# EAGLE design PIC10FXXX_dev (EAGLE 5.11)
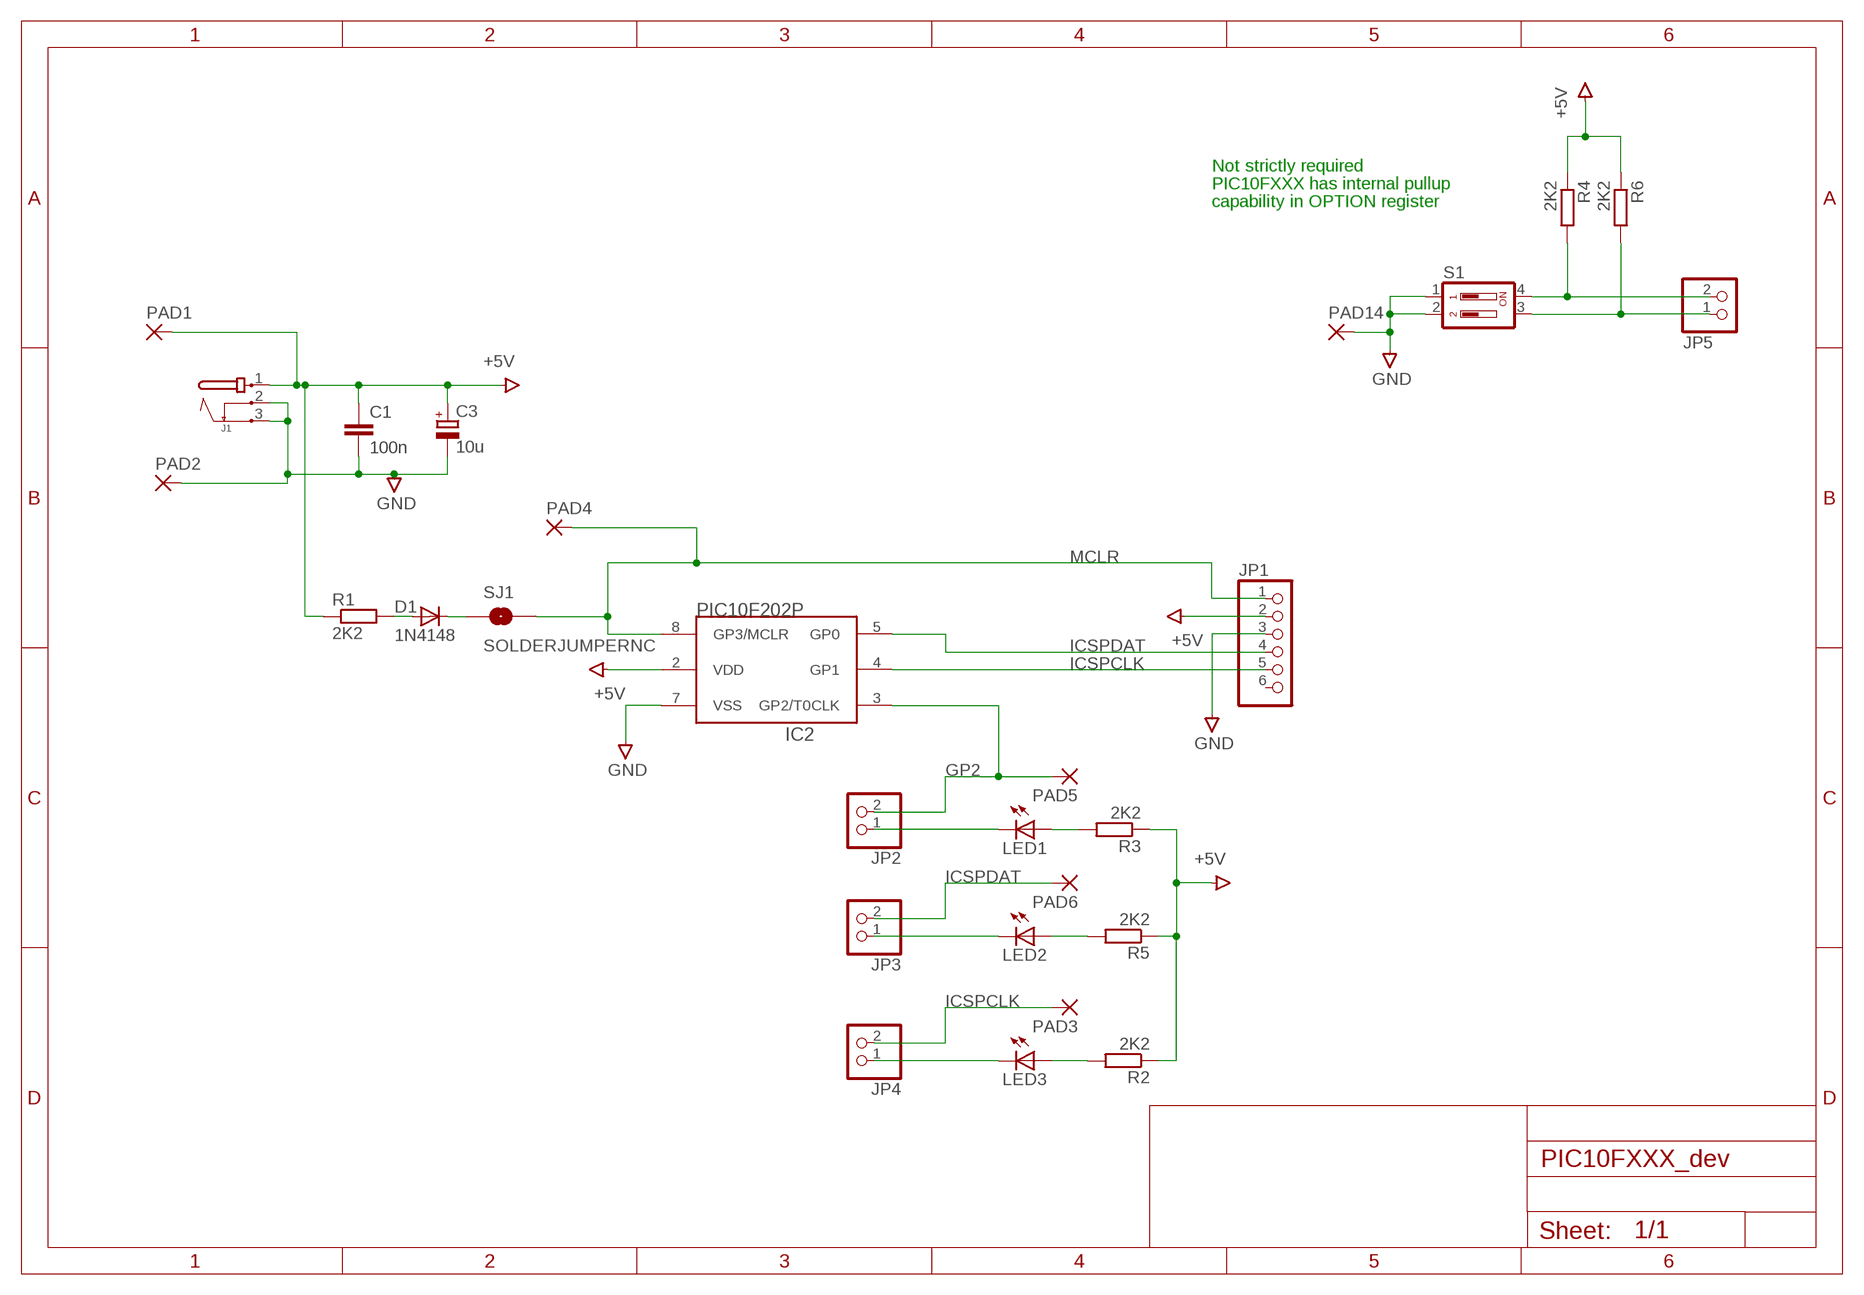
[diagram p0: schematic, sheet 1]

## Parts
C1  100n  C-EU050-035X075  [C050-035X075]
C3  10u  CPOL-EUE2.5-5  [E2,5-5]
D1  1N4148  1N4148DO35-7  [DO35-7]
IC2  PIC10F202P  [DIL8]
J1  JACK-PMS  [JACK-PMS]
JP1  PINHD-1X6  [1X06]
JP2  PINHD-1X2  [1X02]
JP3  PINHD-1X2  [1X02]
JP4  PINHD-1X2  [1X02]
JP5  PINHD-1X2  [1X02]
LED1  LED3MM  [LED3MM]
LED2  LED3MM  [LED3MM]
LED3  LED3MM  [LED3MM]
PAD1  2,15/1,0  [2,15/1,0]
PAD2  2,15/1,0  [2,15/1,0]
PAD3  2,15/1,0  [2,15/1,0]
PAD4  2,15/1,0  [2,15/1,0]
PAD5  2,15/1,0  [2,15/1,0]
PAD6  2,15/1,0  [2,15/1,0]
PAD14  2,15/1,0  [2,15/1,0]
R1  2K2  R-EU_0204/7  [0204/7]
R2  2K2  R-EU_0204/7  [0204/7]
R3  2K2  R-EU_0204/7  [0204/7]
R4  2K2  R-EU_0204/2V  [0204V]
R5  2K2  R-EU_0204/7  [0204/7]
R6  2K2  R-EU_0204/2V  [0204V]
S1  DIP02YL  [DIP02YL]
SJ1  SOLDERJUMPERNC  [SJ_2S]

## Nets
+5V: C1.1 C3.+ IC2.2(VDD) J1.1 JP1.2 PAD1.1(P) R1.1 R2.1 R3.1 R4.1 R5.1 R6.1
GND: C1.2 C3.- IC2.7(VSS) J1.2 J1.3 JP1.3 PAD2.1(P) PAD14.1(P) S1.1 S1.2
GP2: IC2.3(GP2/T0CLK) JP2.2 PAD5.1(P)
ICSPCLK: IC2.4(GP1) JP1.5 JP4.2 PAD3.1(P)
ICSPDAT: IC2.5(GP0) JP1.4 JP3.2 PAD6.1(P)
MCLR: IC2.8(GP3/MCLR) JP1.1 PAD4.1(P) SJ1.2
N$1: D1.C SJ1.1
N$2: D1.A R1.2
N$3: LED3.A R2.2
N$4: LED1.A R3.2
N$6: JP4.1 LED3.K(C)
N$10: LED2.A R5.2
N$11: JP3.1 LED2.K(C)
N$12: JP2.1 LED1.K(C)
N$15: JP5.2 R4.2 S1.4
N$16: JP5.1 R6.2 S1.3
Unconnected: JP1.6

## Notes on the sheet
- Not strictly required
- PIC10FXXX has internal pullup
- capability in OPTION register

## Library data of the parts
C1 = rcl:C-EU: CAPACITOR, European symbol
C3 = rcl:CPOL-EU: POLARIZED CAPACITOR, European symbol
D1 = diode:1N4148: DIODE high speed (Philips)
IC2 = microchip-5:PIC10F20*: uPC nW 0,25/0,5k Program Flash memory
J1 = POWER-IN:JACK-PMS
JP1 = pinhead:PINHD-1X6: PIN HEADER
JP2-JP5 = pinhead:PINHD-1X2: PIN HEADER
LED1-LED3 = led:LED: LED OSRAM: - CHIPLED LG R971, LG N971, LY N971, LG Q971, LY Q971, LO R971, LY R971 LH N974, LH R974 LS Q976, LO Q976, LY Q976 LO Q996 - Hyper CHIPLED LW Q18S LB Q993, LB Q99A, LB R99A - SideLED LS A670, LO A670, LY A670, LG A670, LP A670 LB A673, LV A673, LT A673, LW A673 LH A674 LY A675 LS A676, LA A676, LO A676, LY A676, LW A676 LS A679, LY A679, LG A679 - Hyper Micro SIDELED® LS Y876, LA Y876, LO Y876, LY Y876 LT Y87S - SmartLED LW L88C, LW L88S LB L89C, LB L89S, LG L890 LS L89K, LO L89K, LY L89K LS L896, LA L896, LO L896, LY L896 - TOPLED LS T670, LO T670, LY T670, LG T670, LP T670 LSG T670, LSP T670, LSY T670, LOP T670, LYG T670 LG T671, LOG T671, LSG T671 LB T673, LV T673, LT T673, LW T673 LH T674 LS T676, LA T676, LO T676, LY T676, LB T676, LH T676, LSB T676, LW T676 LB T67C, LV T67C, LT T67C, LS T67K, LO T67K, LY T67K, LW E67C LS E67B, LA E67B, LO E67B, LY E67B, LB E67C, LV E67C, LT E67C LW T67C LS T679, LY T679, LG T679 LS T770, LO T770, LY T770, LG T770, LP T770 LB T773, LV T773, LT T773, LW T773 LH T774 LS E675, LA E675, LY E675, LS T675 LS T776, LA T776, LO T776, LY T776, LB T776 LHGB T686 LT T68C, LB T68C - Hyper Mini TOPLED® LB M676 - Mini TOPLED Santana® LG M470 LS M47K, LO M47K, LY M47K Source: http://www.osram.convergy.de LUXEON: - LUMILED® LXK2-PW12-R00, LXK2-PW12-S00, LXK2-PW14-U00, LXK2-PW14-V00 LXK2-PM12-R00, LXK2-PM12-S00, LXK2-PM14-U00 LXK2-PE12-Q00, LXK2-PE12-R00, LXK2-PE12-S00, LXK2-PE14-T00, LXK2-PE14-U00 LXK2-PB12-K00, LXK2-PB12-L00, LXK2-PB12-M00, LXK2-PB14-N00, LXK2-PB14-P00, LXK2-PB14-Q00 LXK2-PR12-L00, LXK2-PR12-M00, LXK2-PR14-Q00, LXK2-PR14-R00 LXK2-PD12-Q00, LXK2-PD12-R00, LXK2-PD12-S00 LXK2-PH12-R00, LXK2-PH12-S00 LXK2-PL12-P00, LXK2-PL12-Q00, LXK2-PL12-R00 Source: www.luxeon.com KINGBRIGHT: KA-3528ASYC Source: www.kingbright.com
PAD1-PAD6 PAD14 = wirepad:2,15/1,0: THROUGH-HOLE PAD
R1-R6 = rcl:R-EU_: RESISTOR, European symbol
S1 = switch-dil:DIP02YL: DIL/CODE SWITCH; OC_FARNELL: unknown; OC_NEWARK: unknown
SJ1 = SparkFun:SOLDERJUMPER: Solder Jumper Standard SMD solder jumper. Used to automate production. Two varients : Normally Open and Normally Closed are the same, but have different paste layers. NC will have a large amount of paste and should jumper during reflow.

## Board
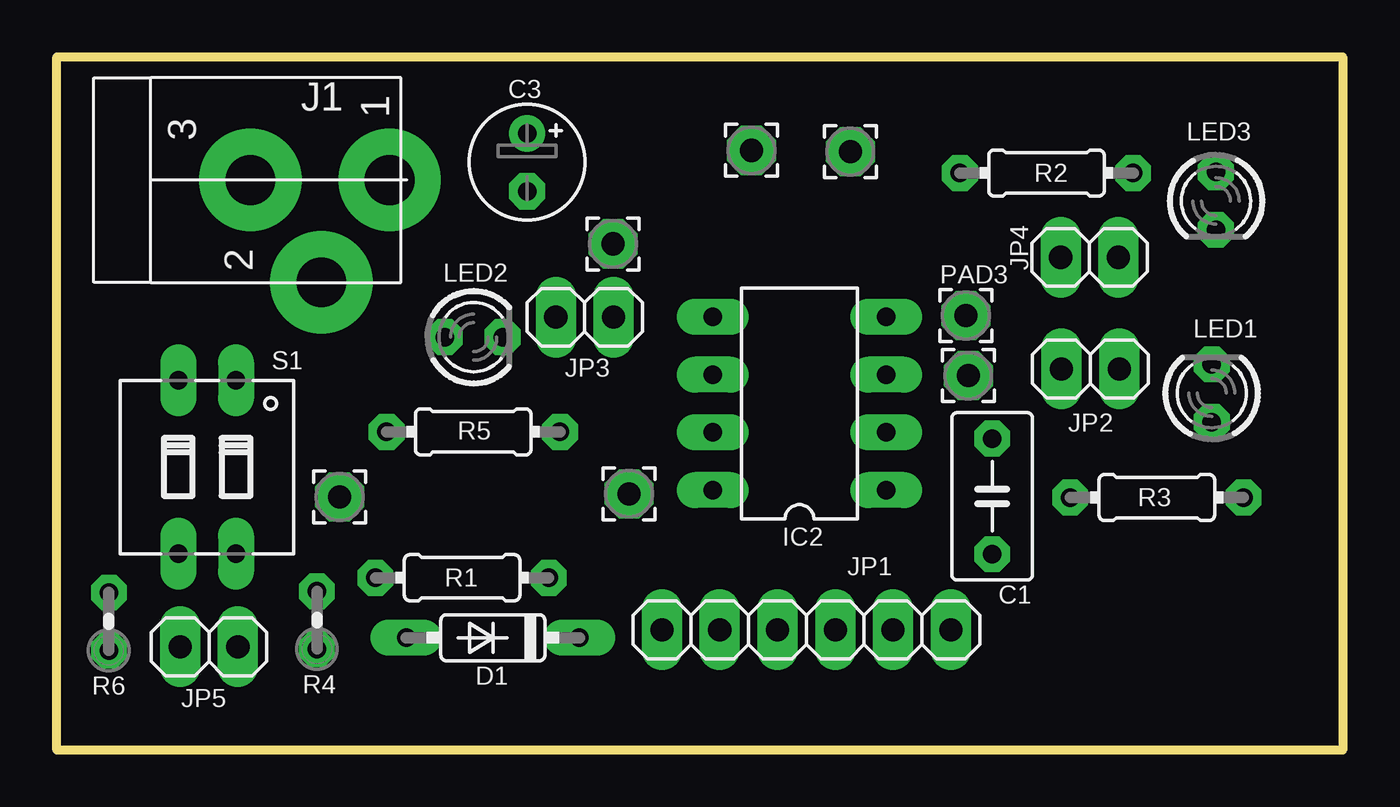
[diagram p1: board, top side]
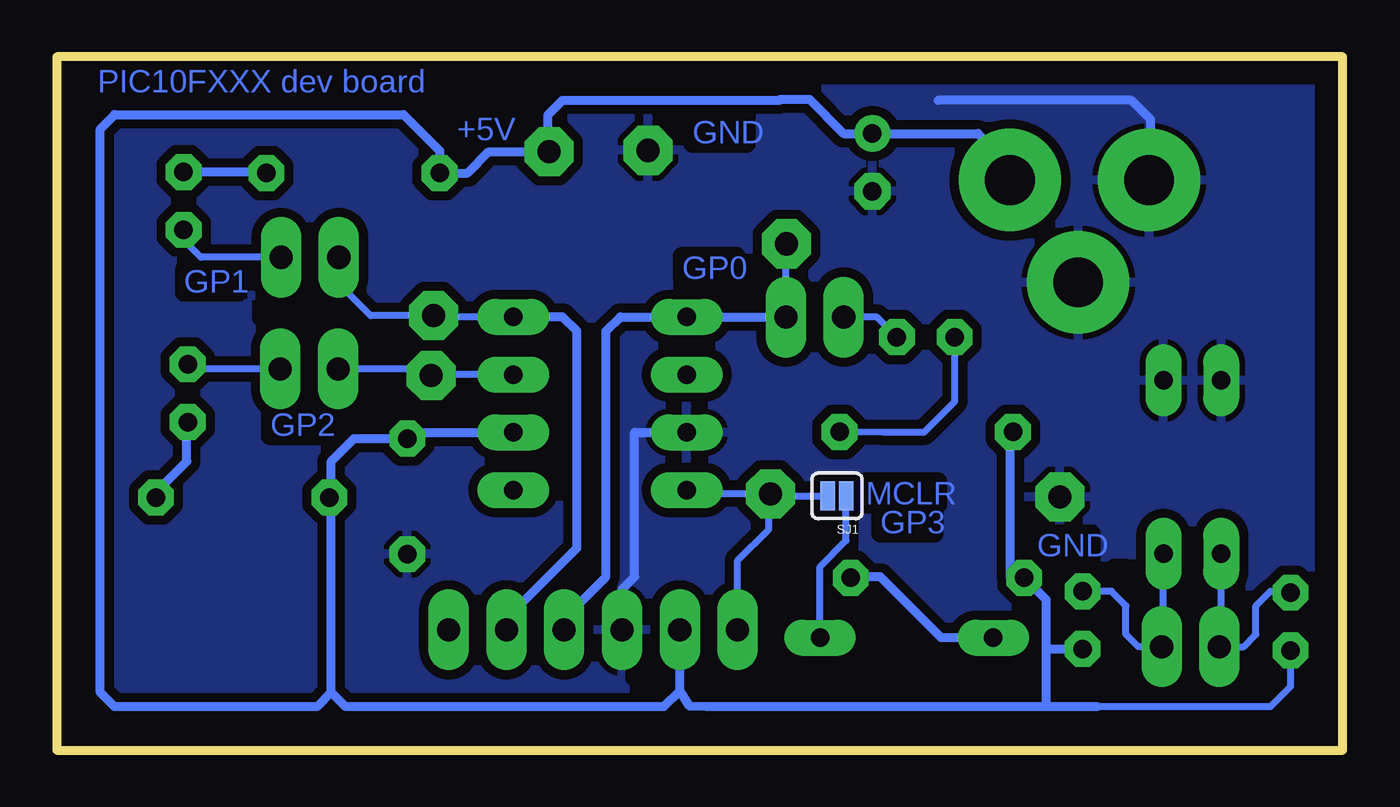
[diagram p2: board, bottom side, seen from below]

Size 56.51 x 30.48 mm. Coordinates in mm from the lower left corner, seen from the top.
Outline: 0,0 0,30.48 56.51,30.48 56.51,0 0,0
Copper layers (1*16): Top 0.035mm / dielectric 1.5mm / Bottom 0.035mm
Design rules "homepcb": minimum track width 10mil, minimum drill 20mil, track to track 10mil, track to pad 10mil, pad to pad 10mil, via to via 10mil, smd to smd 10mil, copper to edge 40mil, drill to drill 10mil, minimum pad ring 15mil, minimum via ring 10mil, stop-mask expansion 0mil, vias tented up to drill 0mil, thermal gap 10mil
bRestrict: area 30.8,3.2 to 31.1,3.5; area 9.5,7.8 to 10,8; area 47.4,19 to 47.5,19.5

### Footprints (pad centres in the part's own frame; a part is rotated, then mirrored left to right if it is on the bottom)
C050-035X075 = drill 0.813 octagon: 1 -2.54,0; 2 2.54,0
E2,5-5 = drill 0.813 pad 1.6 round: + -1.27,0 | drill 0.813 pad 1.6 octagon: - 1.27,0
DO35-7 = drill 0.813 long: A 3.81,0; C -3.81,0
DIL8 = drill 0.813 long: 1 -3.81,-3.81; 2 -1.27,-3.81; 3 1.27,-3.81; 4 3.81,-3.81; 5 3.81,3.81; 6 1.27,3.81; 7 -1.27,3.81; 8 -3.81,3.81
JACK-PMS = drill 2.184 pad 4.5 round: 1 -0.5,-3.31; 2 -5,-0.31; 3 -0.5,2.809
1X06 = drill 1.016 long: 1 -6.35,0; 2 -3.81,0; 3 -1.27,0; 4 1.27,0; 5 3.81,0; 6 6.35,0
1X02 = drill 1.016 long: 1 -1.27,0; 2 1.27,0
LED3MM = drill 0.813 octagon: A -1.27,0; K 1.27,0
2,15/1,0 = drill 1.016 pad 2.159 octagon: 1 0,0
0204/7 = drill 0.813 octagon: 1 -3.81,0; 2 3.81,0
0204V = drill 0.813 octagon: 1 -1.27,0; 2 1.27,0
DIP02YL = drill 0.813 long: 1 -1.27,-3.81; 2 1.27,-3.81; 3 1.27,3.81; 4 -1.27,3.81
SJ_2S = smd 0.635 x 1.27: 1 -0.412,0; 2 0.412,0

### Placement (x,y rotation side)
C1  41.11,11.16 270 top
C3  20.67,25.84 270 top
D1  19.16,4.94 180 top
IC2  32.64,15.24 90 top
J1  11.31,25.56 90 top
JP1  32.95,5.29 0 top
JP2  45.42,16.76 180 top
JP3  23.2,19.03 0 top
JP4  45.39,21.67 180 top
JP5  6.69,4.54 0 top
LED1  50.76,15.7 90 top
LED2  18.32,18.16 0 top
LED3  50.95,24.14 270 top
PAD1  34.88,26.31 270 top
PAD2  30.53,26.37 90 top
PAD3  39.96,19.1 0 top
PAD4  25.15,11.27 0 top
PAD5  40.06,16.46 0 top
PAD6  24.45,22.26 0 top
PAD14  12.42,11.13 0 top
R1  17.81,7.58 0 top
R2  43.5,25.37 0 top
R3  48.35,11.11 0 top
R4  11.43,5.71 90 top
R5  18.3,13.99 0 top
R6  2.29,5.66 90 top
S1  6.6,12.45 180 top
SJ1  22.23,11.18 180 bottom

### Tracks (layer width: path | path; a pad name or v marks a point on that pad's centre or on a via)
+5V
  Bottom 0.305: R6.1 2.29,2.79 3.18,1.9 10.79,1.9
  Bottom 0.406: 14.9,25.06 J1.1 | 14.9,25.06 14.61,24.77 | PAD1.1 34.92,26.36 34.92,27.94 34.29,28.58 24.77,28.58 24.73,28.61 23.43,28.61 21.93,27.11 C3.+ 16.03,27.11 14.9,25.98 14.9,25.06 | PAD1.1 34.92,26.26 | R5.1 14.61,13.88 14.61,7.61 R1.1 13.03,6.61 13.03,4.45 | 29.14,2.62 28.7,1.93 27.94,1.9 13.67,1.9 13.03,1.91 | 29.14,2.62 JP1.2 | 29.14,2.62 29.84,1.9 43.81,1.9 44.45,2.54 | IC2.2 40.84,13.97 C1.1 43.45,13.7 44.45,12.7 44.45,11.2 R3.1 44.45,11.02 44.45,2.54 | 44.45,2.54 45.08,1.9 53.97,1.9 54.61,2.54 54.61,27.3 53.97,27.94 41.27,27.94 39.69,26.35 R2.1 38.47,25.37 37.53,26.31 PAD1.1 | 13.03,1.91 13.03,4.45 | 10.79,1.9 13.03,1.9 13.03,1.91 | 13.03,4.45 R4.1
GND
  Bottom 0.406: 17.78,28.58 9.29,28.58 8.43,27.71 8.43,25.14 J1.3 | JP1.3 31.68,7.06 31.11,7.62 31.11,13.97 IC2.7
  pour Bottom (isolate 0.406): 0.64,30.48 56.51,30.48 56.51,29.21 56.51,0 0.64,0
GP2
  Bottom 0.305: JP2.2 40.35,16.76 PAD5.1 40.01,16.51 IC2.3
ICSPCLK
  Bottom 0.305: IC2.4 39.9,19.05 PAD3.1 42.72,19.1 44.12,20.51 JP4.2
  Bottom 0.406: JP1.5 36.75,5.79 33.65,8.89 33.65,18.41 34.29,19.05 IC2.4
ICSPDAT
  Bottom 0.305: PAD6.1 24.47,22.23 JP3.2
  Bottom 0.406: JP3.2 28.81,19.03 IC2.5 31.75,19.05 32.38,18.41 32.38,7.62 34.29,5.71 34.29,5.37 JP1.4
MCLR
  Bottom 0.305: SJ1.2 25.05,11.18 PAD4.1 | PAD4.1 28.67,11.27 IC2.8 | JP1.1 26.59,8.34 25.23,9.71 25.23,11.19 PAD4.1
N$1
  Bottom 0.305: D1.C 22.97,8.06 21.82,9.21 21.82,11.16 SJ1.1
N$2
  Bottom 0.406: D1.A 17.64,4.94 20.32,7.62 21.58,7.62 R1.2
N$3
  Bottom 0.406: LED3.A 47.31,25.41 R2.2
N$4
  Bottom 0.406: R3.2 52.16,11.34 50.8,12.7 50.8,14.39 LED1.A
N$6
  Bottom 0.305: JP4.1 50.19,21.67 50.93,22.41
  Bottom 0.406: 50.93,22.41 50.95,22.41 LED3.K
N$10
  Bottom 0.305: LED2.A 17.05,15.33 18.41,13.97 20.18,13.97 R5.2
N$11
  Bottom 0.305: LED2.K 20.46,19.03 JP3.1
N$12
  Bottom 0.305: JP2.1 50.6,16.76 LED1.K
N$15
  Bottom 0.305: S1.4 7.87,4.63 JP5.2 8.99,4.54 9.53,5.08 9.53,6.35 10.16,6.98 R4.2
N$16
  Bottom 0.305: S1.3 5.33,4.63 JP5.1 4.35,4.54 3.81,5.08 3.81,6.35 3.18,6.98 2.35,6.98 R6.2

### Text on the board
Bottom: PIC10FXXX dev board | GND | +5V | GP0 | GP1 | GP2 | MCLR | GP3 | GND